# EasyEDA Pro project 0007-Optical_Tracker.epro

# Board 0007-Optical_Tracker
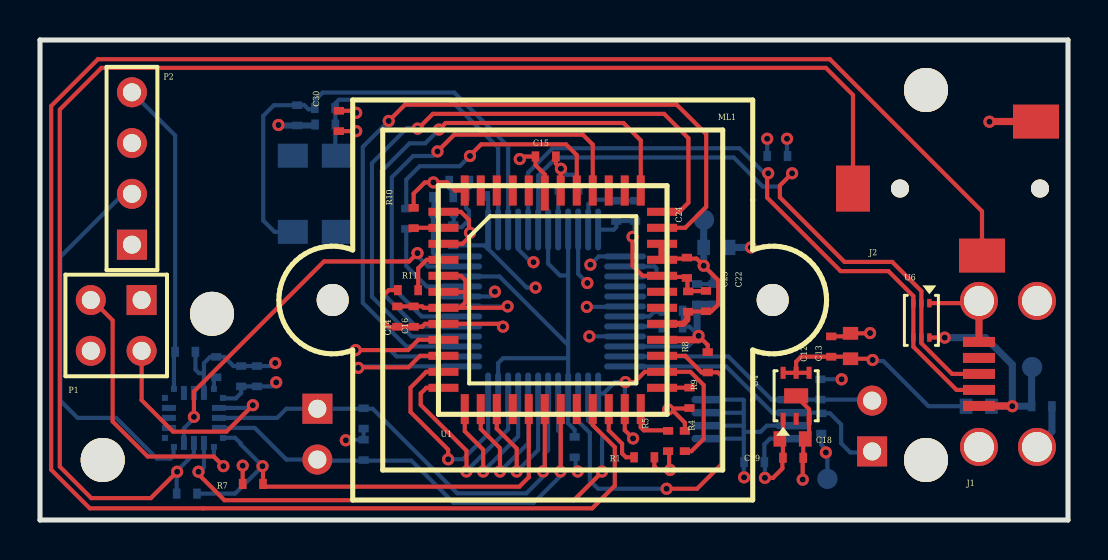
[diagram p0: board, top side]
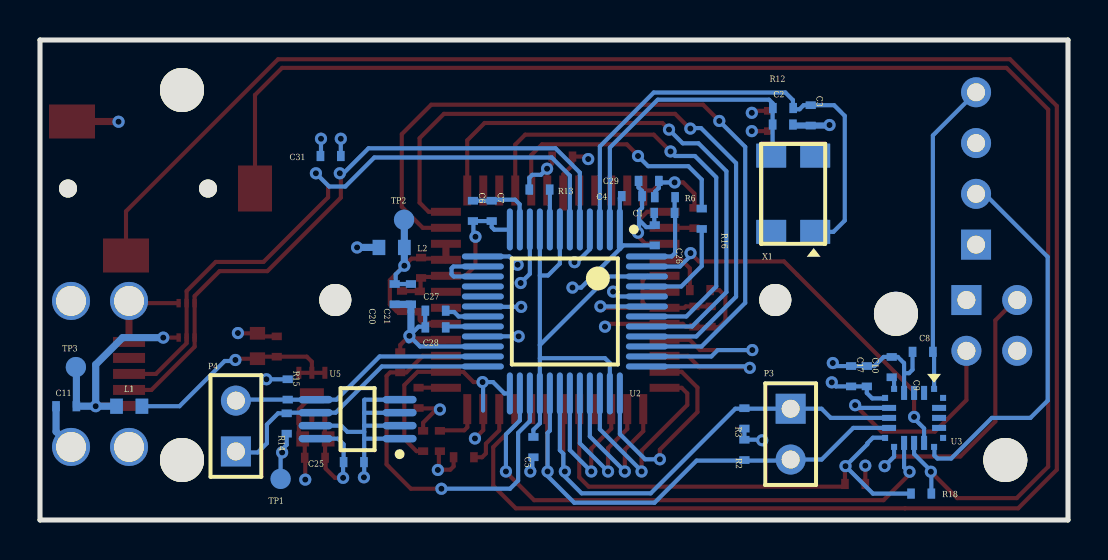
[diagram p1: board, bottom side, seen from below]

Outline 51.4 x 24 mm; copper layers: Top Layer, VDD Plane, GND Plane, Bottom Layer. Coordinates in mm from the lower left corner of the outline.
Outline path: 0,24 51.4,24 51.4,0 0,0 0,24

## Placement (name value [footprint] x y rotation side)
C1  1uF  [CAP_CERAMIC_0402]  20.18 15.35 180 bottom
C2  12pF  [CAP_CERAMIC_0402]  14.26 19.77 0 bottom
C3  12pF  [CAP_CERAMIC_0402]  12.86 20.23 90 bottom
C4  0.1uF  [CAP_CERAMIC_0402]  21.8 16.19 180 bottom
C5  0.1uF  [CAP_CERAMIC_0402]  26.73 3.64 270 bottom
C6  0.1uF  [CAP_CERAMIC_0402]  29.75 15.46 270 bottom
C7  4.7uF  [CAP_CERAMIC_0402]  28.81 15.46 270 bottom
C8  0.1uF  [CAP_CERAMIC_0402]  7.26 8.41 0 bottom
C9  0.1uF  [CAP_CERAMIC_0402]  8.81 7.64 90 bottom
C10  0.1uF  [CAP_CERAMIC_0402]  10.06 7.19 90 bottom
C11  2200pF  [CAP_CERAMIC_0402]  50.09 5.69 0 bottom
C12  2200pF  [CAP_CERAMIC_0402]  39.56 8.67 90 top
C13  10uF  [CAP_CERAMIC_0603]  40.53 8.7 90 top
C14  0.1uF  [CAP_CERAMIC_0402]  17.87 10.17 90 top
C15  1uF  [CAP_CERAMIC_0402]  25.28 18.17 0 top
C16  1uF  [CAP_CERAMIC_0402]  18.68 10.17 90 top
C17  0.1uF  [CAP_CERAMIC_0402]  10.85 7.19 90 bottom
C18  10uF  [CAP_CERAMIC_0603]  37.63 4.05 0 top
C19  0.1uF  [CAP_CERAMIC_0402]  37.65 3.11 0 top
C20  4.7uF  [CAP_CERAMIC_0402]  33.67 11.29 270 bottom
C21  0.1uF  [CAP_CERAMIC_0402]  32.85 11.29 270 bottom
C22  0.1uF  [CAP_CERAMIC_0402]  33.3 10.95 90 top
C23  0.1uF  [CAP_CERAMIC_0402]  32.41 10.92 90 top
C24  0.1uF  [CAP_CERAMIC_0402]  32.35 12.61 270 top
C25  0.1uF  [CAP_CERAMIC_0402]  35.71 2.9 180 bottom
C26  4.7uF  [CAP_CERAMIC_0402]  20.66 14.24 90 bottom
C27  4.7uF  [CAP_CERAMIC_0402]  31.62 10.46 0 bottom
C28  0.1uF  [CAP_CERAMIC_0402]  31.62 9.63 0 bottom
C29  0.1uF  [CAP_CERAMIC_0402]  20.97 16.95 0 bottom
C30  0.1uF  [CAP_CERAMIC_0402]  14.95 19.95 270 top
C31  0.1uF  [CAP_CERAMIC_0402]  36.87 18.2 180 bottom
J1  -  [0513870578]  46.95 7.3 270 top
J2  KYCON STX-2500-3NTR  [KYCON_STX2500]  51.5 16.57 270 top
L1  BLM18KG221SN1D  [INDUCTOR_0603]  46.94 5.69 180 bottom
L2  BLM18KG221SN1D  [INDUCTOR_0603]  33.82 13.63 180 bottom
ML1  -  [CMT103]  25.64 11 0 top
NOREF  -  [Pad_ie8]  8.6 10.31 180 top
NOREF#2  -  [Pad_ie7]  3.14 3 180 top
NOREF#3  -  [Pad_ie5]  44.3 21.5 180 top
NOREF#4  -  [Pad_ie6]  44.3 3 180 top
P1  PPTC022LFBN-RC  [HDR2X2]  5.08 11 180 top
P2  Header 4  [HDR1X4]  4.6 13.77 90 top
P3  Header 2  [HDR1X2]  13.87 5.56 270 bottom
P4  Header 2  [HDR1X2]  41.6 3.43 90 bottom
R1  10K  [RESISTOR_0402]  30.21 3.14 0 top
R2  2.2K  [RESISTOR_0402]  16.18 3.5 90 bottom
R3  2.2K  [RESISTOR_0402]  16.18 5.08 270 bottom
R4  10K  [RESISTOR_0402]  32.24 3.95 270 top
R5  10K  [RESISTOR_0402]  31.41 3.95 90 top
R6  10K  [RESISTOR_0402]  20.15 16.14 0 bottom
R7  2.2K  [RESISTOR_0402]  10.64 1.8 0 top
R8  2.2K  [RESISTOR_0402]  33.39 7.89 270 top
R9  10K  [RESISTOR_0402]  32.47 6.11 270 top
R10  10K  [RESISTOR_0402]  18.68 15.1 90 top
R11  10K  [RESISTOR_0402]  18.4 11.49 180 top
R12  1M  [RESISTOR_0402]  14.25 20.6 180 bottom
R13  6.2K  [RESISTOR_0402]  26.43 16.52 0 bottom
R14  2.2K  [RESISTOR_0402]  39.06 4.83 270 bottom
R15  2.2K  [RESISTOR_0402]  39.01 6.53 90 bottom
R16  30  [RESISTOR_0402]  18.31 15.06 90 bottom
R18  0  [RESISTOR_0402]  7.34 1.32 180 bottom
TP1  TEST POINT  [TEST_POINT_PAD]  39.37 2.06 270 bottom
TP2  TEST POINT  [TEST_POINT_PAD]  33.2 15.01 270 bottom
TP3  TEST POINT  [TEST_POINT_PAD]  49.61 7.64 270 bottom
U1  MT9V034  [CLCC-48]  25.64 11 0 top
U2  eSP570  [LQFP-48_M]  25.16 10.43 270 bottom
U3  STM8S003F3  [20-UFQFN]  7.7 5.11 90 bottom
U4  LP5900SD-3.3  [LLP-6]  37.81 6.21 90 top
U5  24LC128-I/MS  [MSOP-MS8_N]  35.52 5.04 0 bottom
U6  ESDR0502N  [UDFN-6]  44.07 9.98 270 top
X1  12MHz  [4-SMD]  13.74 16.31 90 bottom

## Footprints (pads in the part's own frame, mm; a bottom-side part is the same pattern mirrored in y, then rotated)
4-SMD
  rect 1.2x1.5 smd: 1(-1.9,-1.1) 2(1.91,-1.1) 3(1.91,1.1) 4(-1.9,1.1)
20-UFQFN
  rect 0.3x0.3 smd: 1(1.45,-1) 5(1.45,1) 6(1,1.45) 10(-1,1.45) 11(-1.45,1) 15(-1.45,-1) 16(-1,-1.45) 20(1,-1.45)
  rect 0.7x0.3 smd: 2(1.25,-0.5) 3(1.25,0) 4(1.25,0.5) 12(-1.25,0.5) 13(-1.25,0) 14(-1.25,-0.5)
  rect 0.3x0.7 smd: 7(0.5,1.25) 8(0,1.25) 9(-0.5,1.25) 17(-0.5,-1.25) 18(0,-1.25) 19(0.5,-1.25)
0513870578
  rect 0.5x1.6 smd: 1(1.6,0) 2(0.8,0) 3(0,0) 4(-0.8,0) 5(-1.6,0)
  round 1.9 hole 1.5: 5(3.65,0) 6(-3.65,0) 7(-3.65,2.9) 8(3.65,2.9)
CAP_CERAMIC_0402
  rect 0.381x0.508 smd: 1(-0.508,0) 2(0.508,0)
CAP_CERAMIC_0603
  rect 0.635x0.762 smd: 1(-0.635,0) 2(0.635,0)
CLCC-48
  rect 0.4x1.75 smd: 1(-0.4,5.35)
  rect 0.4x1.5 smd: 2(-1.2,5.475) 3(-2,5.475) 4(-2.8,5.475) 5(-3.6,5.475) 6(-4.4,5.475) 19(-4.4,-5.455) 20(-3.6,-5.455) 21(-2.8,-5.455) 22(-2,-5.455) 23(-1.2,-5.455) 24(-0.4,-5.455) 25(0.4,-5.455) 26(1.2,-5.455) 27(2,-5.455) 28(2.8,-5.455) 29(3.6,-5.455) 30(4.4,-5.455) 43(4.4,5.475) 44(3.6,5.475) 45(2.8,5.475) 46(2,5.475) 47(1.2,5.475) 48(0.4,5.475)
  rect 1.5x0.4 smd: 7(-5.465,4.41) 8(-5.465,3.61) 9(-5.465,2.81) 10(-5.465,2.01) 11(-5.465,1.21) 12(-5.465,0.41) 13(-5.465,-0.39) 14(-5.465,-1.19) 15(-5.465,-1.99) 16(-5.465,-2.79) 17(-5.465,-3.59) 18(-5.465,-4.39) 31(5.465,-4.39) 32(5.465,-3.59) 33(5.465,-2.79) 34(5.465,-1.99) 35(5.465,-1.19) 36(5.465,-0.39) 37(5.465,0.41) 38(5.465,1.21) 39(5.465,2.01) 40(5.465,2.81) 41(5.465,3.61) 42(5.465,4.41)
CMT103
  round 1.6 hole 1.6: 1(11,0) 2(-11,0)
HDR1X2
  rect 1.5x1.5 hole 0.9: 1(0,0)
  round 1.5 hole 0.9: 2(2.54,0)
HDR1X4
  rect 1.5x1.5 hole 0.9: 1(0,0)
  round 1.5 hole 0.9: 2(2.54,0) 3(5.08,0) 4(7.62,0)
HDR2X2
  rect 1.5x1.5 hole 0.9: 1(0,0)
  round 1.5 hole 0.9: 2(0,2.54) 3(2.54,0) 4(2.54,2.54)
INDUCTOR_0603
  rect 0.635x0.762 smd: 1(-0.635,0) 2(0.635,0)
KYCON_STX2500
  round 0.9 hole 0.9: (0,-1.5) (0,-8.5)
  rect 1.7x2.3 smd: 1(-3.35,-1.7) 2(3.35,-4.4)
  rect 2.3x1.7 smd: 3(0,-10.85)
LLP-6
  rect 0.6x0.25 smd: 1(-1.15,0.65) 2(-1.15,0) 3(-1.15,-0.65) 4(1.15,-0.65) 5(1.15,0) 6(1.15,0.65)
  rect 0.75x1.2 smd: 7(0,0)
LQFP-48_M
  oval 2.1x0.3 smd: 1(-4.1,2.75) 2(-4.1,2.25) 3(-4.1,1.75) 4(-4.1,1.25) 5(-4.1,0.75) 6(-4.1,0.25) 7(-4.1,-0.25) 8(-4.1,-0.75) 9(-4.1,-1.25) 10(-4.1,-1.75) 11(-4.1,-2.25) 12(-4.1,-2.75) 25(4.1,-2.75) 26(4.1,-2.25) 27(4.1,-1.75) 28(4.1,-1.25) 29(4.1,-0.75) 30(4.1,-0.25) 31(4.1,0.25) 32(4.1,0.75) 33(4.1,1.25) 34(4.1,1.75) 35(4.1,2.25) 36(4.1,2.75)
  oval 0.3x2.1 smd: 13(-2.75,-4.1) 14(-2.25,-4.1) 15(-1.75,-4.1) 16(-1.25,-4.1) 17(-0.75,-4.1) 18(-0.25,-4.1) 19(0.25,-4.1) 20(0.75,-4.1) 21(1.25,-4.1) 22(1.75,-4.1) 23(2.25,-4.1) 24(2.75,-4.1) 37(2.75,4.1) 38(2.25,4.1) 39(1.75,4.1) 40(1.25,4.1) 41(0.75,4.1) 42(0.25,4.1) 43(-0.25,4.1) 44(-0.75,4.1) 45(-1.25,4.1) 46(-1.75,4.1) 47(-2.25,4.1) 48(-2.75,4.1)
MSOP-MS8_N
  oval 1.7x0.375 smd: 1(-2.1,0.975) 2(-2.1,0.325) 3(-2.1,-0.325) 4(-2.1,-0.975) 5(2.1,-0.975) 6(2.1,-0.325) 7(2.1,0.325) 8(2.1,0.975)
Pad_ie5
  round 2.2 hole 2.2: 0(0,0)
Pad_ie6
  round 2.2 hole 2.2: 0(0,0)
Pad_ie7
  round 2.2 hole 2.2: 0(0,0)
Pad_ie8
  round 2.2 hole 2.2: 0(0,0)
RESISTOR_0402
  rect 0.381x0.508 smd: 1(-0.508,0) 2(0.508,0)
TEST_POINT_PAD
  round 1.016 smd: 1(0,0)
UDFN-6
  rect 0.42x0.22 smd: 1(-0.86,0.4) 2(-0.86,0) 3(-0.86,-0.4) 4(0.86,-0.4) 5(0.86,0) 6(0.86,0.4)

## Nets
GND: C1.1 C2.1 C3.1 C4.2 C5.2 C6.2 C7.2 C8.2 C9.2 C10.2 C11.2 C12.2 C13.2 C14.2 C15.2 C16.2 C17.2 C18.2 C19.2 C20.2 C21.2 C22.2 C23.2 C24.2 C25.2 C26.2 C27.2 C28.2 C29.2 C30.2 C31.2 J1.5 J1.6 J1.7 J1.8 J2.1 P1.4 P2.3 R4.1 R7.1 R8.1 R9.2 R13.2 U1.7 U1.9 U1.11 U1.12 U1.13 U1.29 U1.34 U1.38 U1.48 U2.4 U2.12 U2.18 U2.22 U2.43 U3.4 U4.3 U4.7 U5.1 U5.2 U5.3 U5.4 U5.7 U6.1
VCC3V3A: C20.1 C21.1 C22.1 C23.1 C24.1 L2.2 TP2.1 U1.35 U1.39 U1.40
VCC3V3D: C10.1 C14.1 C15.1 C16.1 C17.1 C18.1 C19.1 C25.1 C29.1 C30.1 C31.1 L2.1 P1.1 P2.1 R1.2 R2.2 R3.2 R5.1 R6.2 R10.2 R11.2 R14.2 R15.2 TP1.1 U1.1 U1.6 U1.14 U3.6 U4.1 U5.8
VCC5V_USB: C11.1 J1.1 L1.1 TP3.1 U6.6
VCC5V_USB_FILT: C12.1 C13.1 L1.2 U2.10 U4.4 U4.5 U4.6
ADR0: R5.2 U1.30
ADR1: R9.1 U1.31
BYPASS_CLKIN_N: R10.1 U1.8
CLK_27: R16.2 U1.47
CLK_27E: R16.1 U2.45
D2: U1.43 U2.41
D3: U1.42 U2.40
D4: U1.41 U2.39
D5: U1.15 U2.38
D6: U1.16 U2.37
D7: U1.17 U2.36
D8: U1.18 U2.34
D9: U1.19 U2.33
ESCL: P4.1 R14.1 U2.24 U5.6
ESDA: P4.2 R15.1 U2.23 U5.5
ESP1V8: C4.1 C26.1 U2.1 U2.13 U2.21 U2.44
ESP2V8: C6.1 C7.1 U2.11
ESP3V3: C5.1 U2.7 U2.9 U2.28 U2.35 U2.46
ESPVAA: U2.14 U2.15
EXP: R7.2 R18.1 U1.23 U3.10
EXT_SYNC: J2.3 R18.2 U3.13
FV: U1.21 U2.31
GPIO0: U2.47 U3.14
GPIO3: U2.26 U3.12
IR_SYNC: P1.3 U3.11
LED_OUT: J2.2 U1.27
LV: U1.20 U2.32
NETC27_1: C27.1 U2.19
NETC28_1: C28.1 U2.20
OE: R1.1 U1.28
PCLK: U1.46 U2.42
REXT: R13.1 U2.8
RSTN: C1.2 R6.1 U2.48
SCL: P3.2 R2.1 U1.25 U2.29 U3.9
SDA: P3.1 R3.1 U1.24 U2.30 U3.8
SER_DATAIN_N: R11.1 U1.10
SRST_B: R4.2 U1.32 U2.25
STATUS_LED: P1.2 U3.7
STBY: R8.2 U1.33 U2.27
UC_RST_B: C8.1 P2.4 U3.1
UC_SWIM: P2.2 U3.15
USBDATA_N: J1.2 U2.5 U6.3 U6.4
USBDATA_P: J1.3 U2.6 U6.2 U6.5
VCAP: C9.1 U3.5
XSCI: C3.2 R12.2 U2.3 X1.1
XSCO: C2.2 R12.1 U2.2 X1.3

Pads without a net: J1 4; ML1 1 2; NOREF 0; NOREF#2 0; NOREF#3 0; NOREF#4 0; U1 2 3 4 5 22 26 36 37 44 45; U2 16 17; U3 2 3 16 17 18 19 20; U4 2; X1 2 4

## Via types
v1: diameter 0.61, hole 0.305, Top Layer to Bottom Layer, 66 vias

## Routing (per net, layer and track width the routed paths; a pad name or vN(x,y) marks a point on that pad's centre or on a via; arc(x,y) is an arc through that point)
GND: length 93.1
  Top Layer w0.207: J1.6 46.84,10.84 U6.1 ; 31.56,5.58 32.47,5.58 ; R7.1 v1(10.13,2.72) ; 15.05,19.44 v1(15.81,19.44) ; v1(41.5,9.35) 41.49,9.33 40.6,9.33 ; U1.9 21.04,13.81 21.05,13.81 21.12,13.81 21.45,14.14 21.45,15 21.04,15.41 U1.7 ; 39.59,9.18 40.45,9.18 40.6,9.33 ; 17.84,10.68 C14.2 C16.2 19.11,10.68 19.18,10.61 U1.13 21,10.61 ; 40.6,9.33 C13.2 ; 32.17,4.46 32.24,4.53 32.24,4.86 31.58,5.53 v1(31.41,5.53) ; v1(29.63,14.16) 29.63,12.71 30.13,12.21 U1.38 31.16,12.15 32.22,12.15 32.37,12 32.37,11.54 32.27,11.44 33.21,11.44 ; 21,10.61 23.31,10.61 v1(23.38,10.68) ; 21,10.61 21.27,10.88 21.27,11.98 21.04,12.21 U1.11 ; 29.27,5.51 U1.29 29.24,4.49 v1(29.65,4.08) ; C15.2 25.79,17.82 v1(26.05,17.56) 26.04,17.56 U1.48 ; 32.95,9.01 32.96,9 ; U4.7 37.81,6.19 38.46,5.53 U4.3 38.46,4.32 38.16,4.03 38.16,3.21 38.14,3.19 38.14,2.05 ; v1(47.47,19.91) 47.48,19.92 ; R8.1 33.39,8.75 v1(32.93,9.21) ; U1.12 21.27,11.41
  Top Layer w0.355: 46.95,8.9 J1.6 ; U1.34 32.95,9.01 ; 47.48,19.92 J2.1
  Bottom Layer w0.207: C5.2 26.78,3.09 26.78,2.48 26.86,2.4 ; 35.19,4.04 35.16,4.07 U5.1 ; 35.19,4.04 35.19,4.41 ; 35.19,4.04 35.19,2.13 ; 33.12,5.36 35.19,5.36 ; 35.19,5.36 35.19,4.72 ; 35.19,5.36 35.19,5.99 35.17,6.02 U5.4 ; 35.19,4.72 35.18,4.72 U5.2 ; 35.19,4.72 35.19,4.41 ; 36.36,18.3 v1(36.36,19.06) ; U2.18 29.24,10.66 v1(27.34,10.66) ; C1.1 20.69,14.77 C26.2 ; 35.19,4.41 36.03,4.41 36.34,4.72 U5.7 ; 24.58,12.87 23.91,13.54 U2.4 ; 21.45,15 21.09,14.64 20.69,14.64 ; 21.45,15 21.45,14.42 v1(21.5,14.36) ; 21.45,15 21.45,15.46 21.3,15.61 C4.2 21.3,16.45 21.47,16.62 21.47,16.93 ; 32.14,10.4 32.14,9.72 32.09,9.67 32.47,9.67 v1(32.93,9.21) 32.4,8.68 U2.22 ; 8.2,7.85 8.51,8.15 9.22,8.15 9.68,7.7 C17.2 11.61,7.7 v1(11.76,7.85) ; 7.8,8.43 C8.2 7.77,7.52 7.95,7.34 8.2,7.34 ; 21.06,10.68 23.38,10.68 v1(23.38,10.68) ; 8.2,7.34 8.2,7.85 ; 8.2,7.34 U3.4 ; 33.62,10.78 33.59,10.78 33.62,10.76 ; v1(26.05,17.56) 26.35,17.26 26.78,17.26 26.94,17.11 R13.2 ; 31.35,5.47 v1(31.41,5.53) ; U2.12 27.99,14.53 27.98,14.52 28.69,14.52 28.81,14.64 C7.2 29.6,14.95 29.73,14.82 29.73,14.26 v1(29.63,14.16)
  Bottom Layer w0.305: v1(11.92,19.75) 11.95,19.72 C3.1 13.7,19.72 C2.1
  Bottom Layer w0.355: C11.2 50.6,4.42 49.81,3.63 ; 32.96,9 32.96,9.21 32.85,9.31 C21.2 33.59,10.78
  vias: v1(24.67,12.89) v1(26.88,2.43) v1(35.2,2.13) v1(38.14,2.02)
VCC3V3A: length 13.1
  Top Layer w0.207: 32.35,10 32.37,10.02 ; U1.39 31.16,13.07 32.83,13.07 v1(33.18,12.71) 33.91,11.99 33.91,10.77 33.56,10.43 32.27,10.43 32.35,10.5
  Top Layer w0.305: U1.35 32.16,9.81 32.35,10 ; 32.37,10.02 32.37,10.43
  Top Layer w0.355: U1.39 U1.40
  Bottom Layer w0.207: v1(33.18,12.71) 33.62,12.28 33.62,11.77 33.59,11.8 C21.1
  Bottom Layer w0.355: v1(33.18,12.71) L2.2 33.18,15.01
VCC3V3D: length 37.4
  Top Layer w0.207: v1(23.99,18.05) 23.86,18.05 23.99,18.17 C15.1 24.78,17.74 25.24,17.28 U1.1 ; v1(23.15,9.67) 23.01,9.81 U1.14 19.26,9.81 19.11,9.67 C16.1 C14.1 17.84,9.67 17.82,9.64 17.46,9.64 17.13,9.97 17.13,11.19 17.44,11.49 17.74,11.49 17.82,11.42 ; 31.53,2.53 31.52,2.52 30.88,2.52 30.72,2.68 R1.2 ; R10.2 18.68,16.32 19.24,16.88 v1(19.67,16.88) 20.36,16.88 20.76,16.47 U1.6 21.24,15.82 ; U4.1 37.16,4.29 36.99,4.13 37.15,3.98 37.15,3.21 37.12,3.19 37.12,2.58 36.65,2.11 v1(36.25,2.11) ; 31.46,2.6 31.46,3.39 R5.1 ; 15.05,20.46 15.71,20.46 v1(15.81,20.36) ; 31.46,2.5 v1(31.51,2.5) ; v1(39.29,3.38) 39.37,3.3
  Bottom Layer w0.207: R3.2 R2.2 15.32,4.01 v1(15.29,3.99) ; R14.2 39.06,3.76 39.29,3.53 v1(39.29,3.38) ; 37.35,18.28 v1(37.35,19.06) ; U3.6 9.17,6.08 9.79,6.08 10.06,6.35 10.06,6.65 10.04,6.66 C10.1 C17.1 11.61,6.68 v1(11.81,6.88) ; v1(36.25,2.11) 36.25,2.87 C25.1 36.22,3.78 36.5,4.07 U5.8 ; 31.49,2.46 31.51,2.45 v1(31.51,2.5) ; v1(19.67,16.88) 20.46,16.88 20.46,16.6 20.64,16.42 20.64,16.17 R6.2 ; TP1.1 39.37,3.3 ; R15.2 v1(40.08,7.04)
  Bottom Layer w0.355: L2.1 v1(35.55,13.63)
VCC5V_USB: length 12.4
  Top Layer w0.207: U6.6 45.23,9.12
  Top Layer w0.355: J1.1 48.6,5.7 v1(48.62,5.69) ; 45.23,9.12 v1(45.24,9.12)
  Bottom Layer w0.355: TP3.1 49.58,7.62 C11.1 v1(48.62,5.69) ; v1(48.62,5.69) 48.62,7.77 47.27,9.12 v1(45.24,9.12) ; v1(48.62,5.69) L1.1
VCC5V_USB_FILT: length 30.1
  Top Layer w0.207: C13.1 41.57,8.06 v1(41.63,8) ; 39.66,8.17 40.5,8.17 40.56,8.1 ; C12.1 39.56,8.17 38.06,8.17 37.81,7.91 U4.5 ; U4.6 U4.5 ; U4.5 U4.4
  VDD Plane w0.254: v1(41.63,8) 36.02,8 32.17,11.85 v1(27.37,11.85)
  Bottom Layer w0.207: L1.2 44.42,5.69 42.16,7.95 41.68,7.95 v1(41.63,8) ; v1(27.37,11.85) 26.91,12.31 U2.10
ADR0: length 2.3
  Top Layer w0.207: 31.35,4.48 30.19,4.48 30.03,4.64 30.03,5.54 U1.30
ADR1: length 1.4
  Top Layer w0.207: U1.31 31.11,6.62 R9.1
BYPASS_CLKIN_N: length 1.3
  Top Layer w0.207: U1.8 18.84,14.61 18.83,14.62
CLK_27: length 12.7
  Top Layer w0.207: U1.47 26.84,18.25 26.3,18.78 22.06,18.78 21.5,18.22 v1(21.5,18.2)
  Bottom Layer w0.207: R16.2 18.31,17.02 18.99,17.69 20.99,17.69 v1(21.5,18.2)
CLK_27E: length 5
  Bottom Layer w0.207: 21.06,11.68 19.34,11.68 18.31,12.7 R16.1
D2: length 27.6
  Top Layer w0.207: v1(19.95,19.52) 20.28,19.85 29.17,19.85 30.04,18.98 U1.43
  Bottom Layer w0.207: 21.06,9.68 18.79,9.68 17.08,11.39 17.08,17.44 18.48,18.83 19.26,18.83 v1(19.95,19.52)
D3: length 34.2
  Top Layer w0.207: U1.42 31.96,15.41 32.42,15.87 32.42,19.09 31.2,20.31 19.65,20.31 18.88,19.55
  Bottom Layer w0.207: 21.06,9.18 18.58,9.18 16.6,11.16 16.6,17.84 18.35,19.6 18.78,19.6 18.93,19.44
  vias: v1(18.88,19.57)
D4: length 38.5
  Top Layer w0.207: v1(17.44,19.95) 18.25,20.77 31.84,20.77 33.31,19.29 33.31,15.66 32.26,14.61 U1.41
  Bottom Layer w0.207: v1(17.44,19.95) 16.14,18.66 16.14,10.86 18.32,8.68 21.06,8.68
D5: length 10
  Top Layer w0.207: v1(15.78,8.5) 18.4,8.5 18.91,9.01 U1.15
  Bottom Layer w0.207: v1(15.78,8.5) 17.51,8.5 17.83,8.18 21.06,8.18
D6: length 10
  Top Layer w0.207: U1.16 19,8.21 18.43,7.63 15.91,7.63 15.91,7.53 15.89,7.51
  Bottom Layer w0.207: 21.06,7.68 21.05,7.68 16.06,7.68 15.89,7.51 ; 15.91,7.53 v1(15.91,7.61)
D7: length 10.9
  Top Layer w0.207: U1.17 19.31,7.41 18.53,6.62 18.53,5.4 20.41,3.52 v1(20.41,3.04)
  Bottom Layer w0.207: U2.36 22.41,4.3 21.14,3.04 v1(20.41,3.04)
D8: length 10.8
  Top Layer w0.207: 21.32,2.45 21.32,3.47 19.04,5.75 19.04,6.33 19.31,6.61 U1.18
  Bottom Layer w0.207: 21.32,2.45 23.41,4.54 U2.34
  vias: v1(21.32,2.43)
D9: length 8.1
  Top Layer w0.207: v1(22.16,2.43) 22.16,3.52 21.24,4.44 U1.19
  Bottom Layer w0.207: U2.33 23.91,4.18 22.16,2.43 v1(22.16,2.43)
ESCL: length 14.6
  Bottom Layer w0.207: R14.1 39.5,5.33 40.06,4.78 40.06,3.83 40.51,3.38 41.5,3.38 41.53,3.35 ; 39.06,5.31 39.01,5.37 U5.6 36.62,5.37 34.31,7.68 U2.24
ESDA: length 13.3
  Bottom Layer w0.207: 41.53,5.79 41.3,6.02 R15.1 ; U2.23 34.42,8.18 36.58,6.02 U5.5 38.97,6.02 39.01,6.06
ESP1V8: length 22.4
  VDD Plane w0.254: v1(24.78,11.62) 24.78,11.24 26.83,9.18 v1(27.47,9.18) ; v1(24.78,11.62) 25.51,11.62 26.66,12.76 v1(27.52,12.76) ; v1(24.78,11.62) 23.16,11.62 22.96,11.42 v1(22.74,11.42)
  Bottom Layer w0.207: 22.41,13.55 U2.1 22.41,16.1 C4.1 ; 22.41,13.55 22.23,13.73 20.81,13.73 ; 22.41,13.55 24.34,11.62 v1(24.78,11.62) ; 21.06,11.18 22.5,11.18 v1(22.74,11.42) ; U2.13 27.93,13.18 v1(27.52,12.76) ; v1(27.47,9.18) 29.37,9.18
ESP2V8: length 3.6
  Bottom Layer w0.207: C7.1 29.6,15.96 ; U2.11 27.42,14.54 27.42,15.79 27.65,16.02 28.87,16.02
ESP3V3: length 25.4
  Bottom Layer w0.207: 26.41,12.22 26,12.22 25.41,12.82 U2.7 ; 26.41,8.09 23.15,8.09 22.91,7.85 U2.35 ; 26.41,8.75 U2.28 26.4,6.32 26.4,4.84 26.73,4.51 C5.1 ; 26.41,8.75 U2.9 ; 26.41,8.75 22.98,12.18 21.06,12.18
ESPVAA: length 3.5
  Bottom Layer w0.207: U2.15 30.72,12.18 30.82,12.28 30.82,12.59 30.73,12.68 U2.14
EXP: length 24.3
  Top Layer w0.207: U1.23 24.44,2.14 23.97,1.67 11.29,1.67 R7.2 11.15,2.67 v1(11.12,2.69)
  Bottom Layer w0.207: 9.17,4.08 U3.10 9.16,4.11 9.75,4.11 10.03,3.83 10.03,3.78 v1(11.12,2.69) 9.75,1.32 R18.1
EXT_SYNC: length 73.6
  Top Layer w0.207: J2.3 40.65,21.25 39.29,22.61 3.07,22.61 0.99,20.52 0.99,2.67 2.56,1.09 5.54,1.09 v1(6.86,2.41)
  Bottom Layer w0.207: v1(6.86,2.41) 6.83,2.39 R18.2 ; 6.93,2.34 6.93,2.54 7.7,3.3 U3.13
FV: length 7.9
  Top Layer w0.207: v1(23.84,2.43) 23.84,3.57 22.84,4.57 U1.21
  Bottom Layer w0.207: v1(23.84,2.43) 24.91,3.5 U2.31 ; 23.71,2.38 23.76,2.38
GPIO0: length 19.4
  Top Layer w0.207: v1(7.7,5.16) 7.7,6.43 14.2,12.93 18.46,12.93 v1(18.87,13.34)
  Bottom Layer w0.207: v1(7.7,5.16) 7.7,5.08 7.2,4.58 U3.14 ; v1(18.87,13.34) 18.87,13.21 19.41,12.67 21.05,12.67 21.06,12.68
GPIO3: length 27.1
  Top Layer w0.207: 7.89,2.32 9.22,0.99 26.69,0.99 28.09,2.39
  Bottom Layer w0.207: U2.26 27.41,4.98 28.1,4.28 28.1,2.48 ; 7.92,2.36 8.2,2.63 U3.12
  vias: v1(7.92,2.41) v1(28.1,2.43)
IR_SYNC: length 14.2
  Top Layer w0.207: v1(9.17,2.69) 8.69,3.17 5.38,3.17 3.63,4.93 3.63,9.98 2.62,11
  Bottom Layer w0.207: v1(9.17,2.69) 8.7,3.17 U3.11 ; P1.3 2.62,11
LED_OUT: length 104.8
  Top Layer w0.207: J2.2 47.1,15.43 39.5,23.04 2.9,23.04 0.56,20.7 0.56,2.51 2.49,0.58 8.15,0.58 8.15,0.58 27.61,0.58 28.74,1.72 28.74,3.64 27.64,4.75 U1.27
LV: length 8
  Top Layer w0.207: v1(23,2.43) 23,3.59 22.04,4.56 U1.20
  Bottom Layer w0.207: v1(23,2.43) 24.41,3.83 U2.32
NETC27_1: length 2
  Bottom Layer w0.207: U2.19 30.47,10.18 30.69,10.4 31.13,10.4
NETC28_1: length 1.8
  Bottom Layer w0.207: 31.08,9.67 31.06,9.68 U2.20
OE: length 3.2
  Top Layer w0.207: U1.28 28.44,4.48 29.1,3.81 29.1,3.33 29.3,3.14 29.68,3.14 29.7,3.11
PCLK: length 23
  Top Layer w0.207: v1(19.87,18.43) 20.71,19.27 27.14,19.27 27.64,18.77 U1.46
  Bottom Layer w0.207: 21.06,10.18 19.08,10.18 17.59,11.67 17.59,17.13 18.66,18.2 19.65,18.2 v1(19.87,18.43)
REXT: length 2
  Bottom Layer w0.207: U2.8 25.91,16.54
RSTN: length 4.3
  Bottom Layer w0.207: R6.1 19.67,16.12 C1.2 19.65,15.33 19.65,13.35 19.82,13.18 21.06,13.18
SCL: length 26.5
  Top Layer w0.207: 26.04,2.43 U1.25
  Bottom Layer w0.207: 13.87,2.97 18.57,2.97 20.68,0.86 24.69,0.86 26.02,2.2 v1(26.02,2.43) 26.02,4.36 25.91,4.47 U2.29 ; U3.9 10.74,4.61 12.32,3.02 P3.2
SDA: length 25.8
  Top Layer w0.207: U1.24 25.24,2.57 25.27,2.54
  Bottom Layer w0.207: U3.8 11.86,5.11 12.32,5.56 P3.1 16.64,5.56 20.86,1.33 24.32,1.33 25.23,2.25 25.23,3.31 25.41,3.49 U2.30
  vias: v1(25.16,2.43)
SER_DATAIN_N: length 2.5
  Top Layer w0.207: 18.91,11.52 18.91,12.59 19.33,13.01 U1.10
SRST_B: length 11.4
  Top Layer w0.207: v1(29.27,6.9) 29.72,6.9 30.24,7.41 U1.32 32.52,7.41 33.18,6.74 33.18,4.05 32.57,3.44 32.17,3.44
  Bottom Layer w0.207: U2.25 28.18,6.33 28.75,6.9 v1(29.27,6.9) ; 29.25,5.47 29.25,6.87
STATUS_LED: length 11
  Top Layer w0.207: v1(10.64,5.74) 9.32,4.42 6.65,4.42 5.08,5.99 P1.2
  Bottom Layer w0.207: v1(10.64,5.74) 10.51,5.61 U3.7
STBY: length 19.7
  Top Layer w0.207: 31.33,1.54 31.35,1.56 32.85,1.56 34.07,2.78 34.07,7.2 33.9,7.38 R8.2 33.08,7.38 32.28,8.18 32.28,8.21 U1.33
  Bottom Layer w0.207: U2.27 26.91,4.94 27.49,4.36 27.49,1.97 27.9,1.56 v1(31.33,1.56) 31.38,1.56
UC_RST_B: length 15.7
  Bottom Layer w0.207: P2.4 6.76,19.23 C8.1 ; U3.1 6.7,8.35
UC_SWIM: length 19.4
  Bottom Layer w0.207: P2.2 4.17,16.31 1.02,13.16 1.02,5.97 1.88,5.11 3.81,5.11 5.84,3.07 6.53,3.07 6.68,3.23 6.68,3.64 U3.15
USBDATA_N: length 33.2
  Top Layer w0.207: J1.2 45.83,6.5 43.67,8.66 U6.4 U6.3 43.67,11.19 42.42,12.44 40.03,12.44 36.36,16.12 36.36,17.28 v1(36.41,17.34)
  Bottom Layer w0.207: v1(36.41,17.34) 36.22,17.34 34.97,18.59 25.62,18.59 24.41,17.37 U2.5
USBDATA_P: length 33.2
  Top Layer w0.207: J1.3 45.6,7.3 44.07,8.84 U6.5 U6.2 44.07,11.45 42.61,12.9 40.22,12.9 37,16.13 37,16.73 v1(37.6,17.34)
  Bottom Layer w0.207: U2.6 24.91,17.22 25.81,18.12 34.69,18.12 36.14,16.67 36.94,16.67 v1(37.6,17.34)
VCAP: length 0.6
  Bottom Layer w0.207: U3.5 8.7,7.02 C9.1
XSCI: length 25.4
  Bottom Layer w0.207: U2.3 23.41,18.68 20.71,21.37 14.13,21.37 13.75,20.99 13.75,20.54 13.42,20.54 13.22,20.74 C3.2 11.69,20.74 11.16,20.21 11.16,14.97 11.73,14.41 12.64,14.41
XSCO: length 15.9
  Bottom Layer w0.207: U2.2 22.91,18.62 20.51,21.02 14.95,21.02 14.77,20.84 C2.2 14.77,18.22

## Copper pours and planes (outline as drawn; the poured copper is in the pictures)
GND on GND Plane: 0,0 0,24 51.4,24 51.4,0
VCC3V3D on VDD Plane: 0,0 0,24 51.4,24 51.4,0

# Board 0007-Optical_Tracker.pcblib
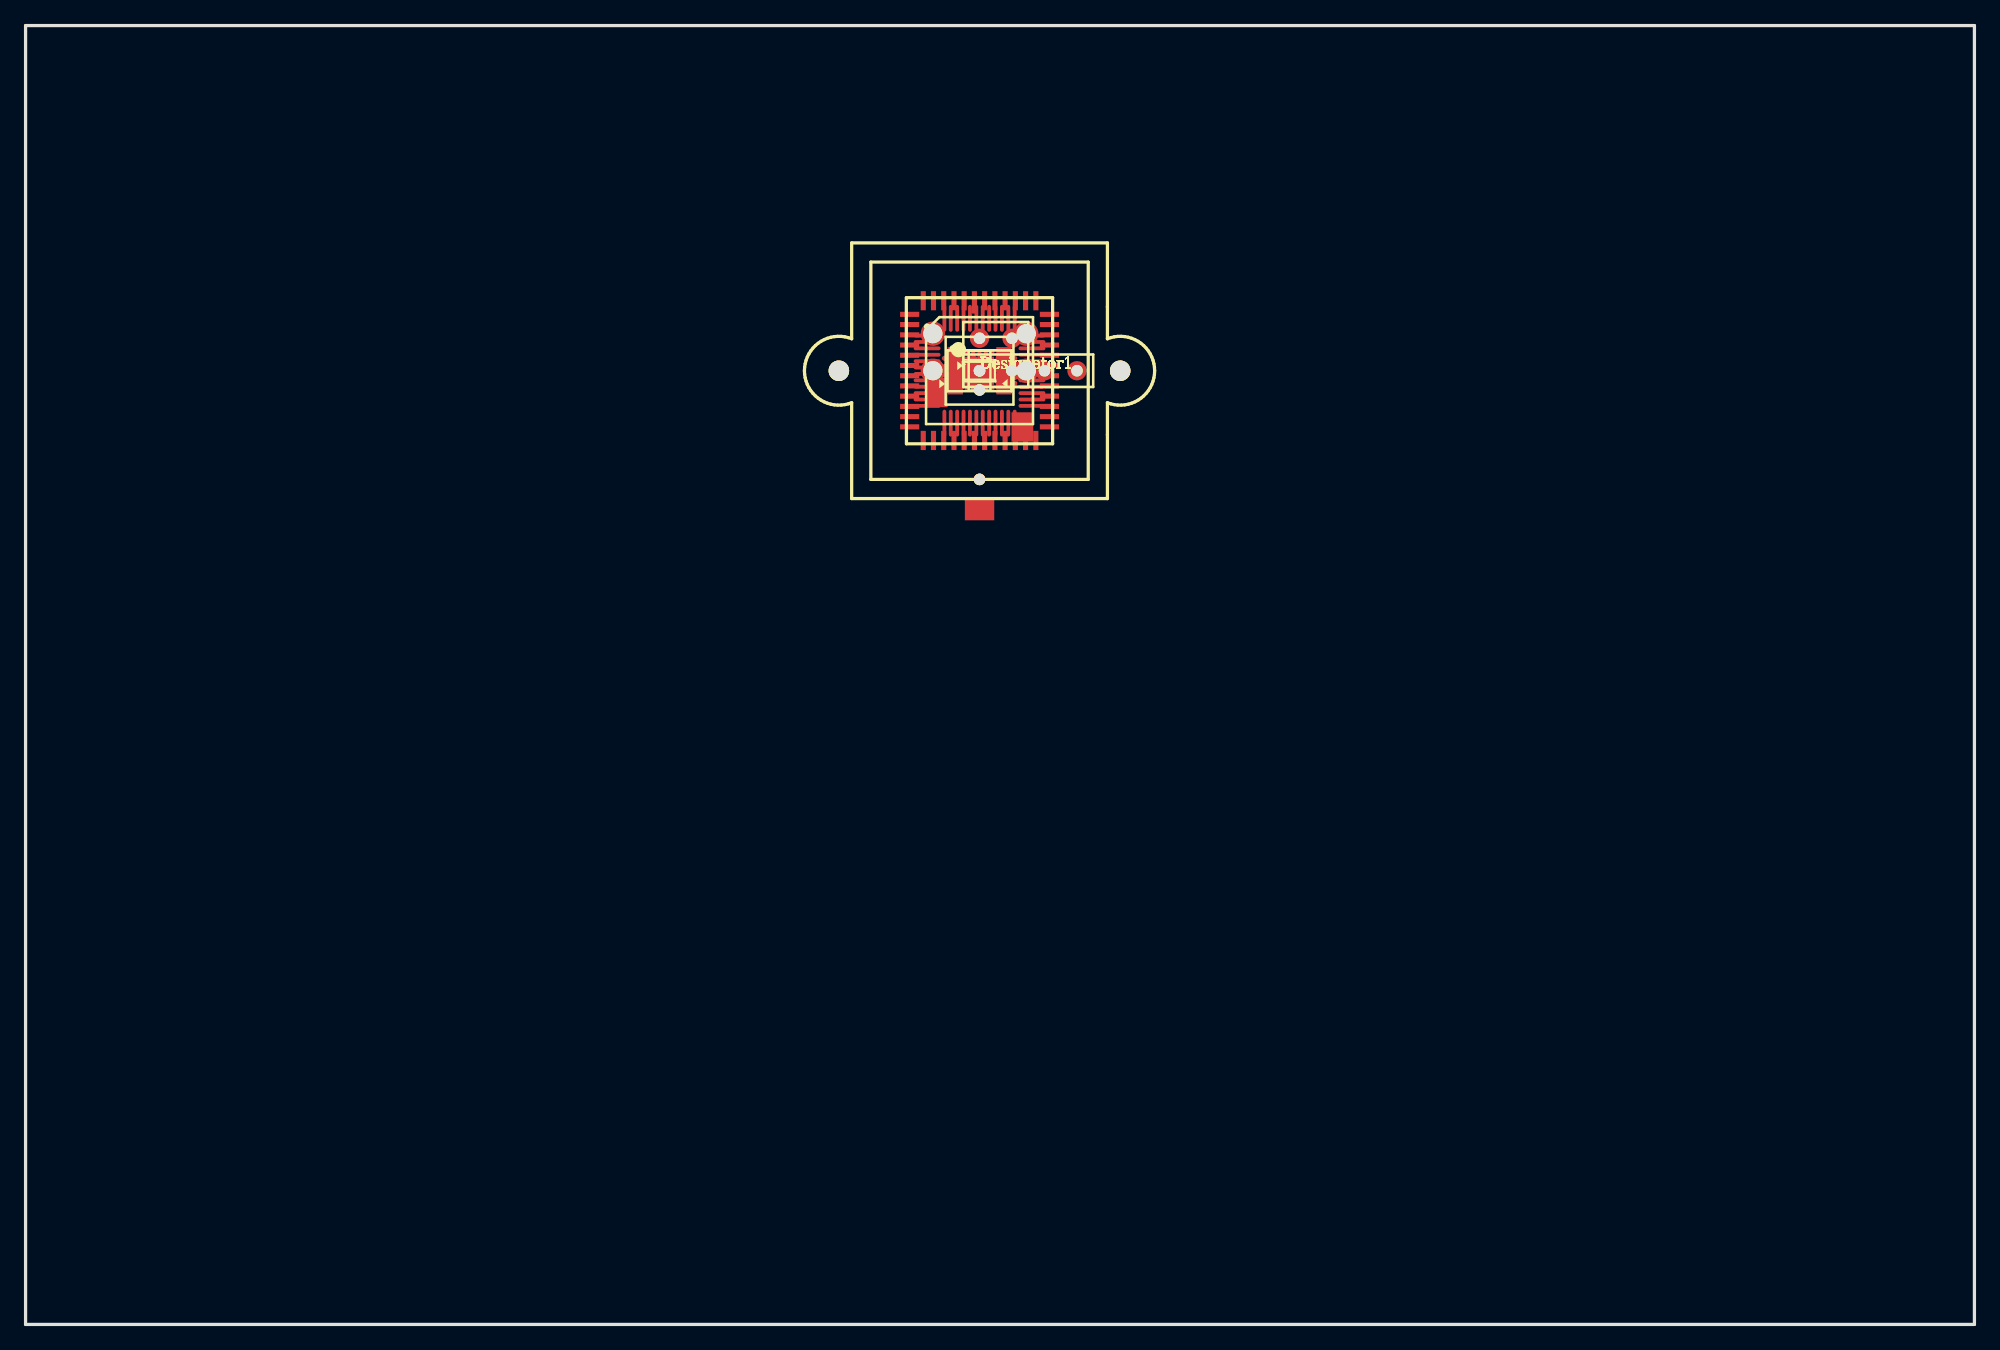
[diagram p2: board, top side]
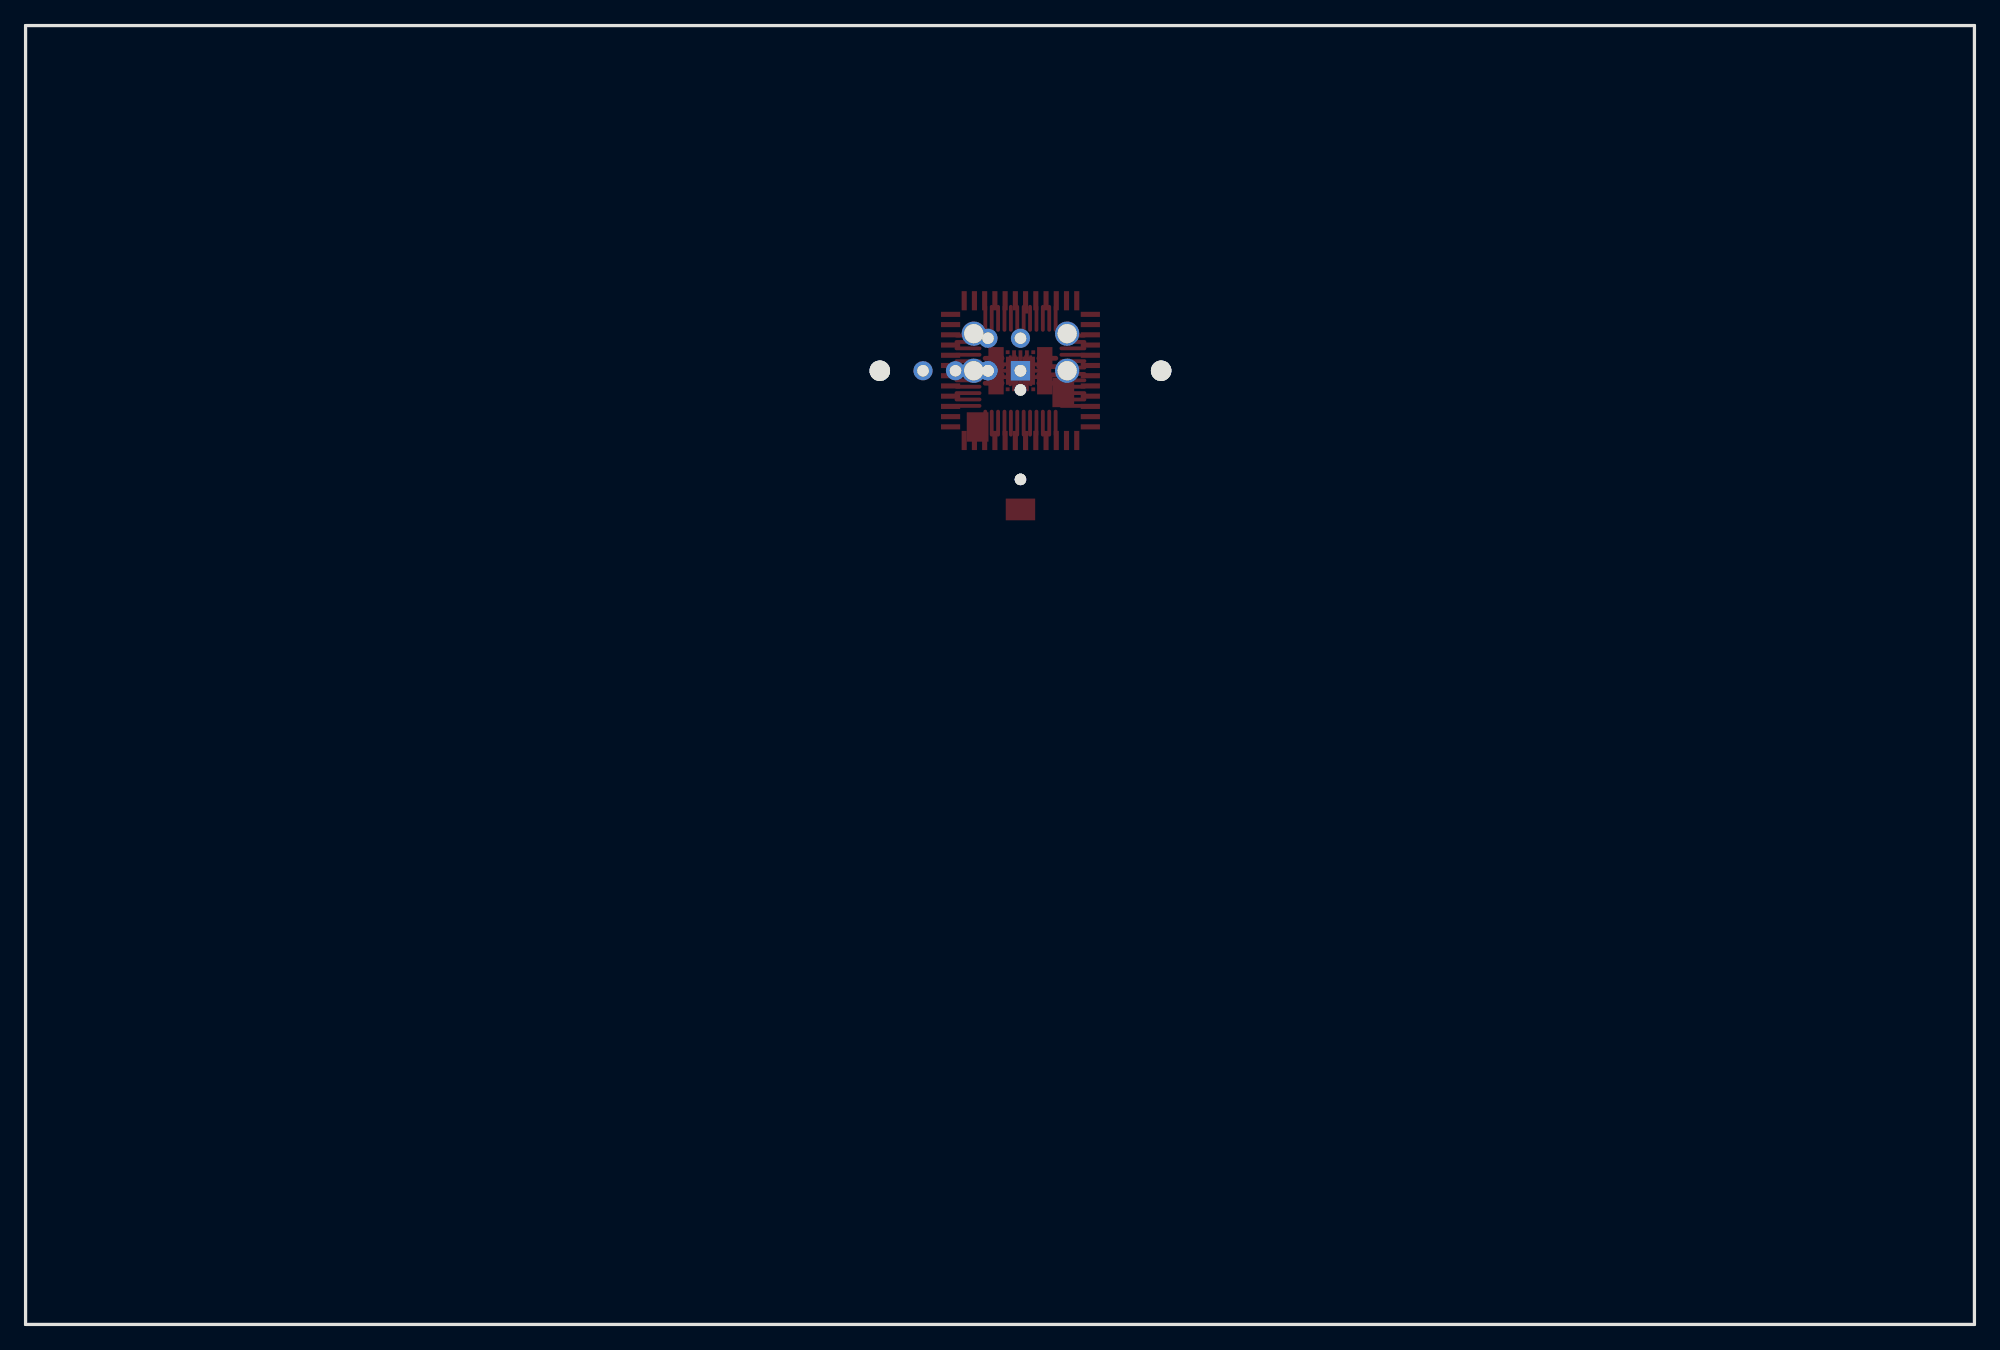
[diagram p3: board, bottom side, seen from below]

Outline 152.4 x 101.6 mm; copper layers: Top Layer, Bottom Layer. Coordinates in mm from the lower left corner of the outline.
Outline path: 0,101.6 0,0 152.4,0 152.4,101.6 0,101.6

## Placement (name value [footprint] x y rotation side)
Designator1  -  [MSOP-MS8_N]  74.6 74.6 0 top
Designator1#2  -  [UQFN-6L]  74.6 74.6 0 top
Designator1#3  -  [4-SMD]  74.6 74.6 0 top
Designator1#4  -  [CAP_CERAMIC_0402]  74.6 74.6 0 top
Designator1#5  -  [0513870578]  74.6 74.6 0 top
Designator1#6  -  [LQFP-48_M]  74.6 74.6 0 top
Designator1#7  -  [LED_GREEN_0603]  74.6 74.6 0 top
Designator1#8  -  [UDFN-6]  74.6 74.6 0 top
Designator1#9  -  [HDR2X2]  74.6 74.6 0 top
Designator1#10  -  [TSOP6456]  74.6 74.6 0 top
Designator1#11  -  [TEST_POINT_PAD]  74.6 74.6 0 top
Designator1#12  -  [RESISTOR_0603]  74.6 74.6 0 top
Designator1#13  -  [20-UFQFN]  74.6 74.6 0 top
Designator1#14  -  [CMT103]  74.6 74.6 0 top
Designator1#15  -  [CLCC-48]  74.6 74.6 0 top
Designator1#16  -  [RESISTOR_0402]  74.6 74.6 0 top
Designator1#17  -  [HDR1X4]  74.6 74.6 0 top
Designator1#18  -  [LED_BLUE_0603]  74.6 74.6 0 top
Designator1#19  -  [KYCON_STX2500]  74.6 74.6 0 top
Designator1#20  -  [10-DFN]  74.6 74.6 0 top
Designator1#21  -  [CAP_CERAMIC_0603]  74.6 74.6 0 top
Designator1#22  -  [INDUCTOR_0603]  74.6 74.6 0 top

## Footprints (pads in the part's own frame, mm; a bottom-side part is the same pattern mirrored in y, then rotated)
4-SMD
  rect 1.2x1.5 smd: 1(-1.9,-1.1) 2(1.91,-1.1) 3(1.91,1.1) 4(-1.9,1.1)
10-DFN
  rect 0.225x0.6 smd: 1(0.8,0.9) 2(0.4,0.9) 3(0,0.9) 4(-0.4,0.9) 5(-0.8,0.9) 6(-0.8,-0.9) 7(-0.4,-0.9) 8(0,-0.9) 9(0.4,-0.9) 10(0.8,-0.9)
20-UFQFN
  rect 0.3x0.3 smd: 1(1.45,-1) 5(1.45,1) 6(1,1.45) 10(-1,1.45) 11(-1.45,1) 15(-1.45,-1) 16(-1,-1.45) 20(1,-1.45)
  rect 0.7x0.3 smd: 2(1.25,-0.5) 3(1.25,0) 4(1.25,0.5) 12(-1.25,0.5) 13(-1.25,0) 14(-1.25,-0.5)
  rect 0.3x0.7 smd: 7(0.5,1.25) 8(0,1.25) 9(-0.5,1.25) 17(-0.5,-1.25) 18(0,-1.25) 19(0.5,-1.25)
0513870578
  rect 0.5x1.6 smd: 1(1.6,0) 2(0.8,0) 3(0,0) 4(-0.8,0) 5(-1.6,0)
  round 1.9 hole 1.5: 5(3.65,0) 6(-3.65,0) 7(-3.65,2.9) 8(3.65,2.9)
CAP_CERAMIC_0402
  rect 0.381x0.508 smd: 1(-0.508,0) 2(0.508,0)
CAP_CERAMIC_0603
  rect 0.635x0.762 smd: 1(-0.635,0) 2(0.635,0)
CLCC-48
  rect 0.4x1.75 smd: 1(-0.4,5.35)
  rect 0.4x1.5 smd: 2(-1.2,5.475) 3(-2,5.475) 4(-2.8,5.475) 5(-3.6,5.475) 6(-4.4,5.475) 19(-4.4,-5.455) 20(-3.6,-5.455) 21(-2.8,-5.455) 22(-2,-5.455) 23(-1.2,-5.455) 24(-0.4,-5.455) 25(0.4,-5.455) 26(1.2,-5.455) 27(2,-5.455) 28(2.8,-5.455) 29(3.6,-5.455) 30(4.4,-5.455) 43(4.4,5.475) 44(3.6,5.475) 45(2.8,5.475) 46(2,5.475) 47(1.2,5.475) 48(0.4,5.475)
  rect 1.5x0.4 smd: 7(-5.465,4.41) 8(-5.465,3.61) 9(-5.465,2.81) 10(-5.465,2.01) 11(-5.465,1.21) 12(-5.465,0.41) 13(-5.465,-0.39) 14(-5.465,-1.19) 15(-5.465,-1.99) 16(-5.465,-2.79) 17(-5.465,-3.59) 18(-5.465,-4.39) 31(5.465,-4.39) 32(5.465,-3.59) 33(5.465,-2.79) 34(5.465,-1.99) 35(5.465,-1.19) 36(5.465,-0.39) 37(5.465,0.41) 38(5.465,1.21) 39(5.465,2.01) 40(5.465,2.81) 41(5.465,3.61) 42(5.465,4.41)
CMT103
  round 1.6 hole 1.6: 1(11,0) 2(-11,0)
HDR1X4
  rect 1.5x1.5 hole 0.9: 1(0,0)
  round 1.5 hole 0.9: 2(2.54,0) 3(5.08,0) 4(7.62,0)
HDR2X2
  rect 1.5x1.5 hole 0.9: 1(0,0)
  round 1.5 hole 0.9: 2(0,2.54) 3(2.54,0) 4(2.54,2.54)
INDUCTOR_0603
  rect 0.635x0.762 smd: 1(-0.635,0) 2(0.635,0)
KYCON_STX2500
  round 0.9 hole 0.9: (0,-1.5) (0,-8.5)
  rect 1.7x2.3 smd: 1(-3.35,-1.7) 2(3.35,-4.4)
  rect 2.3x1.7 smd: 3(0,-10.85)
LED_BLUE_0603
  rect 0.6x1 smd: 1(-0.7,0) 2(0.7,0)
LED_GREEN_0603
  rect 0.6x1 smd: 1(-0.7,0) 2(0.7,0)
LQFP-48_M
  oval 2.1x0.3 smd: 1(-4.1,2.75) 2(-4.1,2.25) 3(-4.1,1.75) 4(-4.1,1.25) 5(-4.1,0.75) 6(-4.1,0.25) 7(-4.1,-0.25) 8(-4.1,-0.75) 9(-4.1,-1.25) 10(-4.1,-1.75) 11(-4.1,-2.25) 12(-4.1,-2.75) 25(4.1,-2.75) 26(4.1,-2.25) 27(4.1,-1.75) 28(4.1,-1.25) 29(4.1,-0.75) 30(4.1,-0.25) 31(4.1,0.25) 32(4.1,0.75) 33(4.1,1.25) 34(4.1,1.75) 35(4.1,2.25) 36(4.1,2.75)
  oval 0.3x2.1 smd: 13(-2.75,-4.1) 14(-2.25,-4.1) 15(-1.75,-4.1) 16(-1.25,-4.1) 17(-0.75,-4.1) 18(-0.25,-4.1) 19(0.25,-4.1) 20(0.75,-4.1) 21(1.25,-4.1) 22(1.75,-4.1) 23(2.25,-4.1) 24(2.75,-4.1) 37(2.75,4.1) 38(2.25,4.1) 39(1.75,4.1) 40(1.25,4.1) 41(0.75,4.1) 42(0.25,4.1) 43(-0.25,4.1) 44(-0.75,4.1) 45(-1.25,4.1) 46(-1.75,4.1) 47(-2.25,4.1) 48(-2.75,4.1)
MSOP-MS8_N
  oval 1.7x0.375 smd: 1(-2.1,0.975) 2(-2.1,0.325) 3(-2.1,-0.325) 4(-2.1,-0.975) 5(2.1,-0.975) 6(2.1,-0.325) 7(2.1,0.325) 8(2.1,0.975)
RESISTOR_0402
  rect 0.381x0.508 smd: 1(-0.508,0) 2(0.508,0)
RESISTOR_0603
  rect 0.635x0.762 smd: 1(-0.635,0) 2(0.635,0)
TEST_POINT_PAD
  round 1.016 smd: 1(0,0)
TSOP6456
  rect 1x2.2 smd: 1(-1.905,0) 2(-0.635,0) 3(0.635,0) 3(1.905,0)
UDFN-6
  rect 0.42x0.22 smd: 1(-0.86,0.4) 2(-0.86,0) 3(-0.86,-0.4) 4(0.86,-0.4) 5(0.86,0) 6(0.86,0.4)
UQFN-6L
  rect 0.6x0.25 smd: 1(-0.65,0.5) 2(-0.65,0) 3(-0.65,-0.5) 4(0.65,-0.5) 5(0.65,0) 6(0.65,0.5)

## Nets

Pads without a net: Designator1 1 2 3 4 5 6 7 8; Designator1#2 1 2 3 4 5 6; Designator1#3 1 2 3 4; Designator1#4 1 2; Designator1#5 1 2 3 4 5 6 7 8; Designator1#6 1 2 3 4 5 6 7 8 9 10 11 12 13 14 15 16 17 18 19 20 21 22 23 24 25 26 27 28 29 30 31 32 33 34 35 36 37 38 39 40 41 42 43 44 45 46 47 48; Designator1#7 1 2; Designator1#8 1 2 3 4 5 6; Designator1#9 1 2 3 4; Designator1#10 1 2 3; Designator1#11 1; Designator1#12 1 2; Designator1#13 1 2 3 4 5 6 7 8 9 10 11 12 13 14 15 16 17 18 19 20; Designator1#14 1 2; Designator1#15 1 2 3 4 5 6 7 8 9 10 11 12 13 14 15 16 17 18 19 20 21 22 23 24 25 26 27 28 29 30 31 32 33 34 35 36 37 38 39 40 41 42 43 44 45 46 47 48; Designator1#16 1 2; Designator1#17 1 2 3 4; Designator1#18 1 2; Designator1#19 1 2 3; Designator1#20 1 2 3 4 5 6 7 8 9 10; Designator1#21 1 2; Designator1#22 1 2
